# Altium schematic sheet Power_Discrete - Features.SchDoc: Power Discrete - Features
size A3; Date: Not used; ApprovedBy: Not used; CheckedBy: Not used; Author: Not used; CompanyName: STMicroelectronics; DrawnBy: Not used; Engineer: Not used; Organization: Not used; Address1: Not used; Address2: Not used; Address3: Not used; Address4: Not used; DocumentNumber: Not used; Revision: Not used; SheetNumber: 5; SheetTotal: 19; CurrentTime: Not used; CurrentDate: Not used; Time: Not used; DocumentFullPathAndName: Not used; DocumentName: Not used; ModifiedDate: Not used; ImagePath: Not used; ProjectName: Not used; Application_BuildNumber: Not used
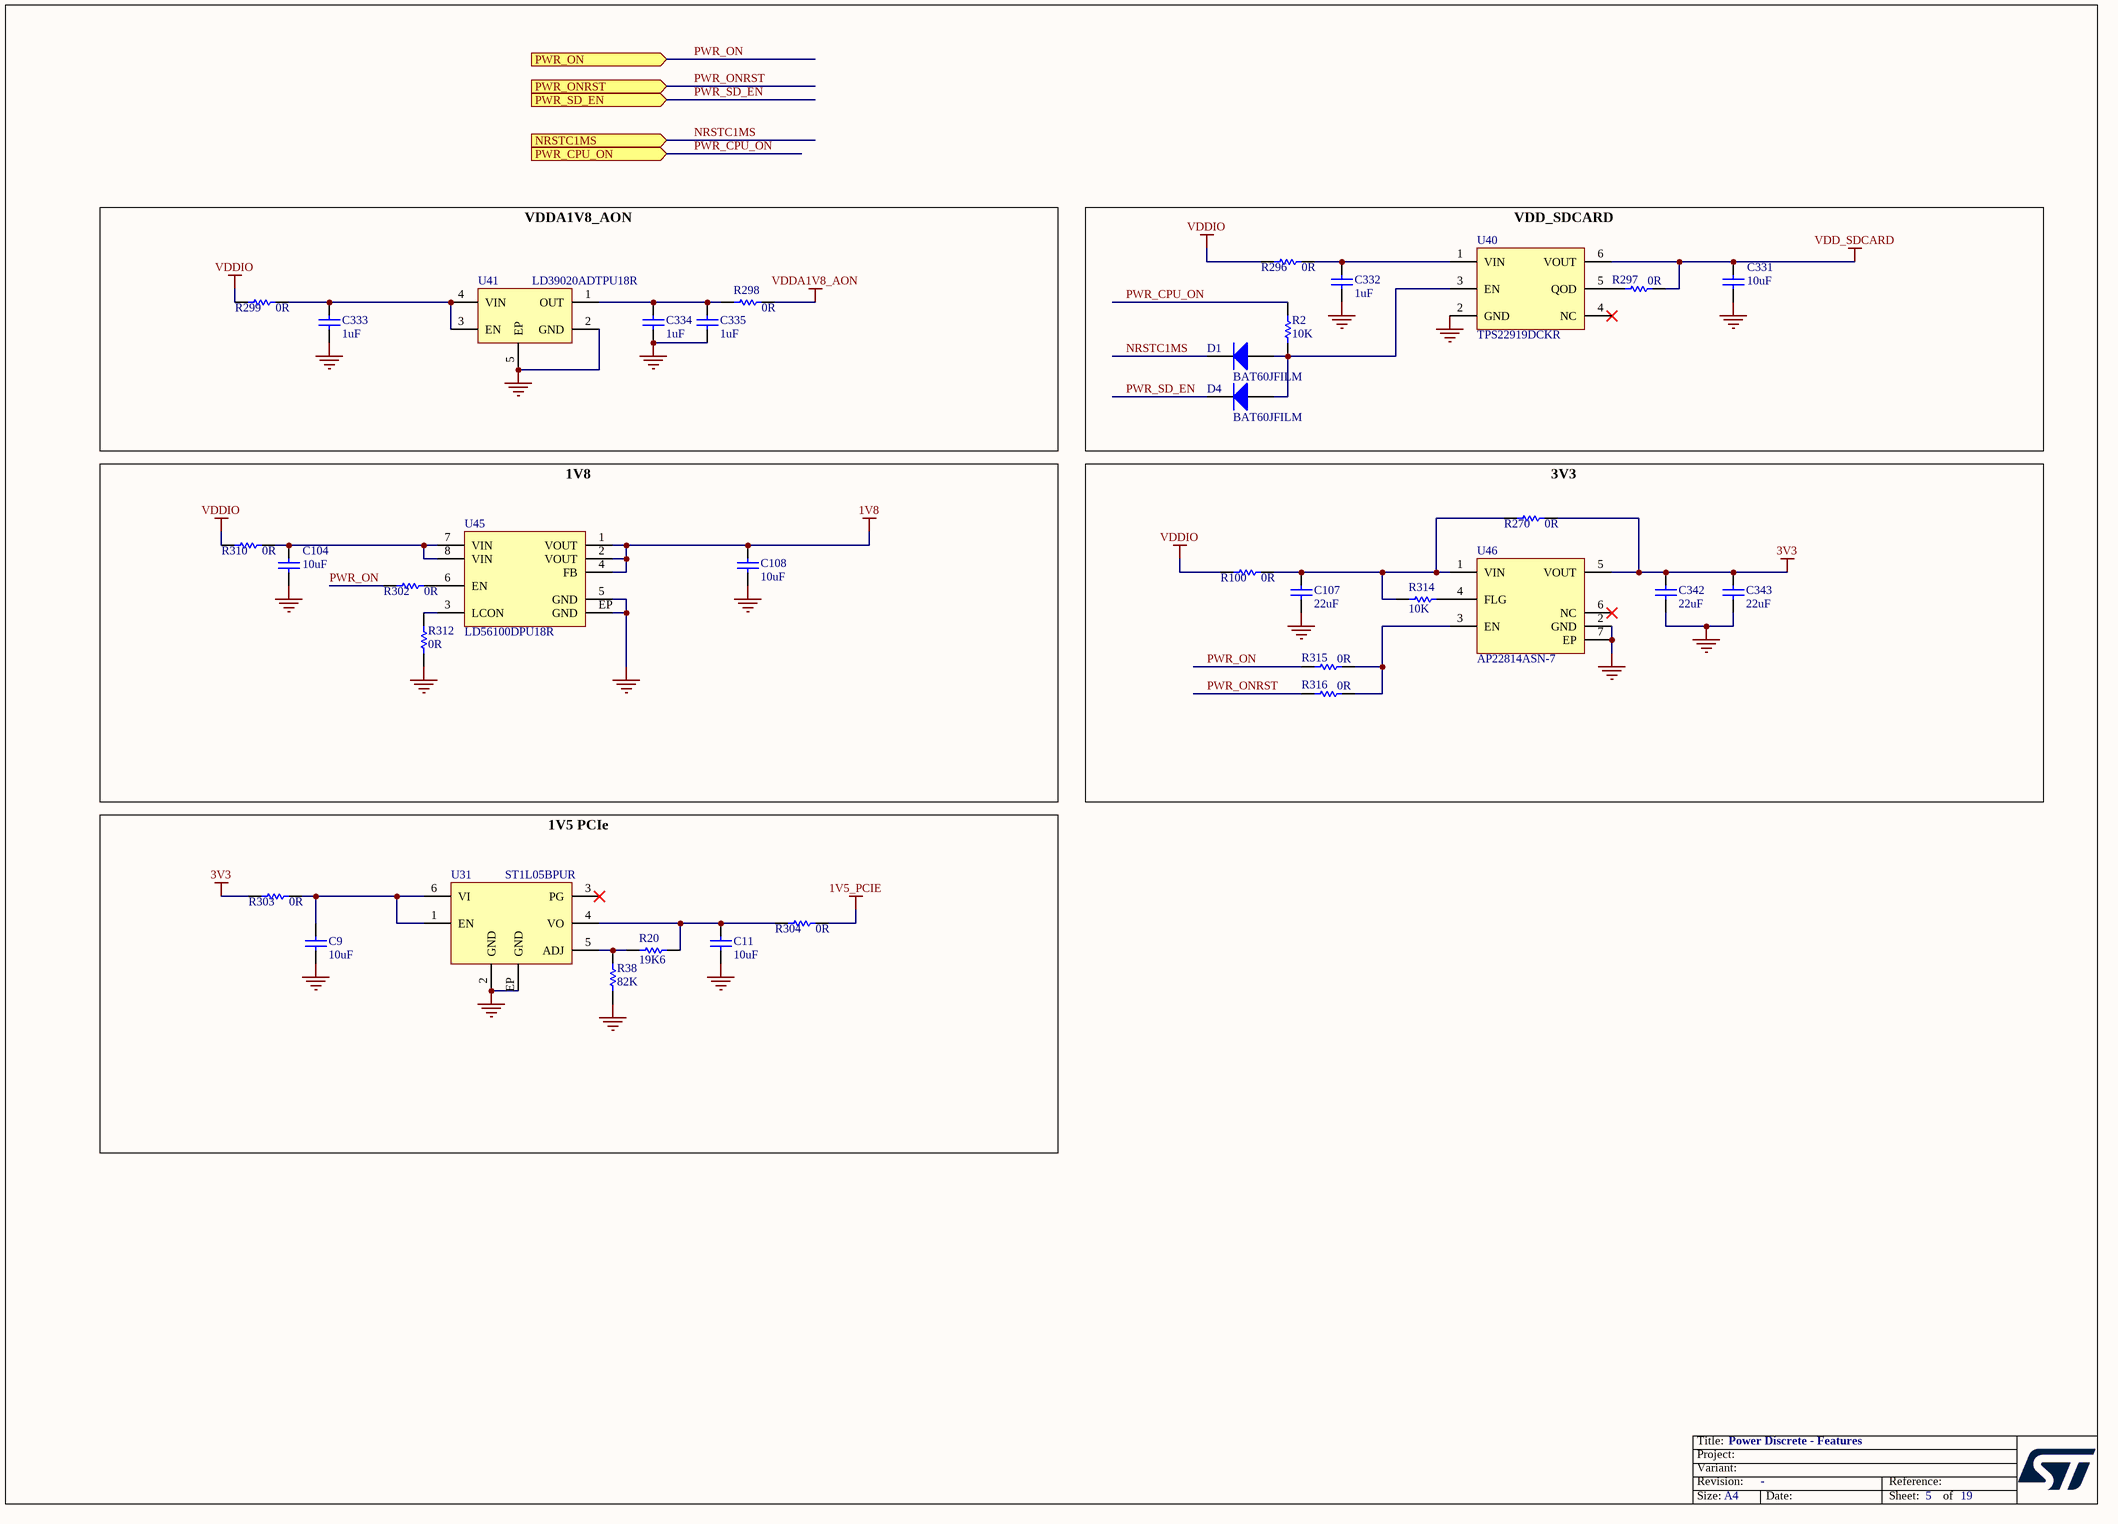
[diagram p0: Power_Discrete - Features.SchDoc]

## Parts
C9  value 10uF  [C0402]  (hidden comment: Capacitor)
C11  value 10uF  [C0402]  (hidden comment: Capacitor)
C104  value 10uF  [C0603]  (hidden comment: Capacitor)
C107  value 22uF  [C0603]  (hidden comment: Capacitor)
C108  value 10uF  [C0603]  (hidden comment: Capacitor)
C331  value 10uF  [C0603]  (hidden comment: Capacitor)
C332  value 1uF  [C0402]  (hidden comment: Capacitor)
C333  value 1uF  [C0402]  (hidden comment: Capacitor)
C334  value 1uF  [C0402]  (hidden comment: Capacitor)
C335  value 1uF  [C0402]  (hidden comment: Capacitor)
C342  value 22uF  [C0603]  (hidden comment: Capacitor)
C343  value 22uF  [C0603]  (hidden comment: Capacitor)
D1  BAT60JFILM  [DIO_SOD323]
D4  BAT60JFILM  [DIO_SOD323]
R2  value 10K  [R0402]  (hidden comment: Resistor)
R20  value 19K6  [R0402]  (hidden comment: Resistor)
R38  value 82K  [R0402]  (hidden comment: Resistor)
R100  value 0R  [R0603]  (hidden comment: Resistor)
R270  value 0R  [R0603]  (hidden comment: Resistor)
R296  value 0R  [R0603]  (hidden comment: Resistor)
R297  value 0R  [R0402]  (hidden comment: Resistor)
R298  value 0R  [R0603]  (hidden comment: Resistor)
R299  value 0R  [R0603]  (hidden comment: Resistor)
R302  value 0R  [R0603]  (hidden comment: Resistor)
R303  value 0R  [R0603]  (hidden comment: Resistor)
R304  value 0R  [R0603]  (hidden comment: Resistor)
R310  value 0R  [R0603]  (hidden comment: Resistor)
R312  value 0R  [R0402]  (hidden comment: Resistor)
R314  value 10K  [R0402]  (hidden comment: Resistor)
R315  value 0R  [R0402]  (hidden comment: Resistor)
R316  value 0R  [R0402]  (hidden comment: Resistor)
U31  ST1L05BPUR  [ICC_DFN6-EPAD_3X3_P095]
U40  value TPS22919DCKR  [ICC_SC70-6_DCK_R-PDSO-G6_2X1P25_P065]  (hidden comment: TPS22919)
U41  value LD39020ADTPU18R  [REG_XDFN4-EPAD_CASE-711AJ_1X1_H0P4_P065]  (hidden comment: LD39020)
U45  LD56100DPU18R  [ICC_DFN8-EPAD_1P6X1P2_P040_H0P45]
U46  AP22814ASN-7

## Ports
NRSTC1MS (in), PWR_CPU_ON (in), PWR_ON (in), PWR_ONRST (in), PWR_SD_EN (in)

## Nets
1V5_PCIE: R304.2
1V8: C108.2 U45.1(VOUT) U45.2(VOUT) U45.4(FB)
3V3: C342.2 C343.2 R270.2 R303.1 U46.5(VOUT)
GND: C9.1 C11.1 C104.1 C107.1 C108.1 C331.1 C332.1 C333.1 C334.1 C335.1 C342.1 C343.1 R38.1 R312.1 U31.2(GND) U31.EP(GND) U40.2(GND) U41.2(GND) U41.5(EP) U45.5(GND) U45.EP(GND) U46.2(GND) U46.7(EP)
VDD_SDCARD: C331.2 R297.2 U40.6(VOUT)
VDDA1V8_AON: R298.2
VDDIO: R100.1 R296.1 R299.1 R310.1
NRSTC1MS: D1.2(K) ; port NRSTC1MS
PWR_CPU_ON: R2.1 ; port PWR_CPU_ON
PWR_ON: R302.1 R315.1 ; port PWR_ON
PWR_ONRST: R316.1 ; port PWR_ONRST
PWR_SD_EN: D4.2(K) ; port PWR_SD_EN
NetC9_2: C9.2 R303.2 U31.1(EN) U31.6(VI)
NetC11_2: C11.2 R20.2 R304.1 U31.4(VO)
NetC104_2: C104.2 R310.2 U45.7(VIN) U45.8(VIN)
NetC107_2: C107.2 R100.2 R270.1 R314.1 U46.1(VIN)
NetC332_2: C332.2 R296.2 U40.1(VIN)
NetC333_2: C333.2 R299.2 U41.3(EN) U41.4(VIN)
NetC334_2: C334.2 C335.2 R298.1 U41.1(OUT)
NetD1_1: D1.1(A) D4.1(A) R2.2 U40.3(EN)
NetR20_1: R20.1 R38.2 U31.5(ADJ)
NetR297_1: R297.1 U40.5(QOD)
NetR302_2: R302.2 U45.6(EN)
NetR312_2: R312.2 U45.3(LCON)
NetR314_2: R314.2 U46.4(FLG)
NetR315_2: R315.2 R316.2 U46.3(EN)

Not connected (* = marked no-connect by the designer): U31 3(PG)*; U40 4(NC)*; U46 6(NC)*

## Notes on the sheet
- VDDA1V8_AON
- VDD_SDCARD
- 1V8
- 3V3
- 1V5 PCIe
- Title:
- Project:
- Size:
- Revision:
- Variant:
- A4
- -
- Date:
- Reference:
- Sheet:
- of

## Library data of the parts
C9 C11 = MCD-01532: Capacitor, MLCC, 10uF, 10V, X5R, +/-20%, 0402, T=0.5mm; Part_Preference: Recommended; Manufacturer: MURATA; Manufacturer_Part_Number: GRM155R61A106ME11; Component_Country_Of_Origin: Japan; ShowFields: YES; ID: 3632; Internal_Part_Number: MCD-01532; Status: Checked; Part_Type: Capacitor; Package: 0402; ComponentLink1URL: http://tunmcdsvn.tun.st.com/Component_Documentation_Library/Trunk/Capacitor/MURATA_GRM_Series; Order_Code_Digikey: N/A; Order_Code_Farnell: N/A; Order_Code_RS: N/A
C104 C331 = MCD-00099: Capacitor, MLCC, 10uF, 10V, X5R, +/-10%, 0603, T=0,8mm; Manufacturer_Part_Number: GRM188R61A106KE69D; Manufacturer: MURATA; Part_Preference: Recommended; Order_Code_RS: 170-6168; Component_Country_Of_Origin: Japan; ID: 2770; ShowFields: YES; Internal_Part_Number: MCD-00099; Status: Released; Part_Type: Capacitor; Package: 0603; ComponentLink1Description: Datasheet; ComponentLink1URL: http://tunmcdsvn.tun.st.com/Component_Documentation_Library/Trunk/Capacitor/MURATA_GRM_Series; Order_Code_Digikey: 490-10474-1-ND; Order_Code_Farnell: 2494233; Alternate_Manufacturer: N/A; Alternate_Manufacturer_Part_Number: N/A
C107 C342 C343 = MCD-00100: Capacitor, MLCC, 22uF, 6V3, X5R, +/-20%, 0603, T=0,8mm; Manufacturer_Part_Number: GRM188R60J226MEA0J; Manufacturer: MURATA; Part_Preference: Recommended; Component_Country_Of_Origin: Japan; ID: 2766; ShowFields: YES; Internal_Part_Number: MCD-00100; Status: Released; Part_Type: Capacitor; Package: 0603; ComponentLink1Description: Datasheet; ComponentLink1URL: http://tunmcdsvn.tun.st.com/Component_Documentation_Library/Trunk/Capacitor/MURATA_GRM_Series; Order_Code_Digikey: 490-7612-2-ND; Order_Code_Farnell: N/A; Order_Code_RS: N/A; Alternate_Manufacturer: N/A; Alternate_Manufacturer_Part_Number: N/A
C108 = MCD-00099: Capacitor, MLCC, 10uF, 10V, X5R, +/-10%, 0603, T=0.8mm; Part_Preference: Recommended; Manufacturer: MURATA; Manufacturer_Part_Number: GRM188R61A106KE69D; Order_Code_RS: 170-6168; Component_Country_Of_Origin: Japan; ShowFields: YES; ID: 2770; Internal_Part_Number: MCD-00099; Status: Released; Part_Type: Capacitor; Package: 0603; ComponentLink1URL: http://tunmcdsvn.tun.st.com/Component_Documentation_Library/Trunk/Capacitor/MURATA_GRM_Series; Order_Code_Digikey: 490-10474-1-ND; Order_Code_Farnell: 2494233
C332 = MCD-00095: Capacitor, MLCC, 1uF, 25V, X5R, +/-10%, 0402, T=0,5mm; Manufacturer_Part_Number: GRM155R61E105KA12; Manufacturer: MURATA; Alternate_Manufacturer_Part_Number: GRM155R60J105KE19; Part_Preference: Recommended; Order_Code_RS: 846-7287; Component_Country_Of_Origin: Japan; ID: 2772; ShowFields: YES; Internal_Part_Number: MCD-00095; Status: Released; Part_Type: Capacitor; Package: 0402; ComponentLink1Description: Datasheet; ComponentLink1URL: http://tunmcdsvn.tun.st.com/Component_Documentation_Library/Trunk/Capacitor/MURATA_GRM_Series; Alternate_Manufacturer: MURATA; Order_Code_Digikey: 490-10017-1-ND; Order_Code_Farnell: 2218855
C333-C335 = MCD-00095: Capacitor, MLCC, 1uF, 25V, X5R, +/-10%, 0402, T=0.5mm; Part_Preference: Recommended; Manufacturer: MURATA; Manufacturer_Part_Number: GRM155R61E105KA12; Alternate_Manufacturer_Part_Number: GRM155R60J105KE19; Order_Code_RS: 846-7287; Component_Country_Of_Origin: Japan; ID: 2772; ShowFields: YES; Internal_Part_Number: MCD-00095; Status: Released; Part_Type: Capacitor; Alternate_Manufacturer: MURATA; Package: 0402; ComponentLink1URL: http://tunmcdsvn.tun.st.com/Component_Documentation_Library/Trunk/Capacitor/MURATA_GRM_Series; Order_Code_Digikey: 490-10017-1-ND; Order_Code_Farnell: 2218855
D1 D4 = MCD-00034: Manufacturer: STMICROELECTRONICS; Part_Type: Diode; BMS_Part_Number: 9151097; Part_Preference: Recommended; Manufacturer_HQ_COO: EU; Component_Country_Of_Origin: China; ID: 2483; ShowFields: YES; Internal_Part_Number: MCD-00034; Value: BAT60JFILM; Manufacturer_Part_Number: BAT60JFILM; ComponentLink1Description: Datasheet; Status: Released; ComponentLink1URL: http://tunmcdsvn.tun.st.com/Component_Datasheet_Library/Trunk/Diodes/STM_Diode_BAT60JFILM-SOD323
R2 R314 = MCD-00053: Resistor,10K,0402,1%,1/16W; Manufacturer_Part_Number: RC0402FR-0710KL; Manufacturer: YAGEO; BMS_Part_Number: 9131590; Part_Preference: Recommended; Component_Country_Of_Origin: China; ID: 2539; ShowFields: YES; Internal_Part_Number: MCD-00053; ComponentLink1Description: Datasheet; Status: Released; Part_Type: Resistor; ComponentLink1URL: http://tunmcdsvn.tun.st.com/Component_Documentation_Library/Trunk/Resistor/YAGEO_RC_L_Series; Package: 0402; Order_Code_Digikey: 311-10.0KLRCT-ND; Order_Code_Farnell: 9239359; Order_Code_RS: N/A; Alternate_Manufacturer: N/A; Alternate_Manufacturer_Part_Number: N/A
R20 = MCD-00344: Resistor, 19K6, 0402, +/-1%, 1/16W; Part_Preference: Recommended; Manufacturer: YAGEO; Manufacturer_Part_Number: RC0402FR-0719K6L; Component_Country_Of_Origin: China; ShowFields: YES; ID: 2937; Internal_Part_Number: MCD-00344; Status: Released; Part_Type: Resistor; Package: 0402; ComponentLink1URL: http://tunmcdsvn.tun.st.com/Component_Documentation_Library/Trunk/Resistor/YAGEO_RC_L_Series; Order_Code_Digikey: YAG3026CT-ND; Order_Code_Farnell: N/A; Order_Code_RS: N/A
R38 = MCD-00531: Resistor, 82K, 0402, +/-1%, 1/16W; Part_Preference: Recommended; Manufacturer: YAGEO; Manufacturer_Part_Number: RC0402FR-0782KL; Component_Country_Of_Origin: China; ShowFields: YES; ID: 3207; Internal_Part_Number: MCD-00531; Status: Released; Part_Type: Resistor; Package: 0402; ComponentLink1URL: http://tunmcdsvn.tun.st.com/Component_Documentation_Library/Trunk/Resistor/YAGEO_RC_L_Series; Order_Code_Digikey: 311-82.0KLRCT-ND; Order_Code_Farnell: 9239464; Order_Code_RS: N/A
R100 R270 R296 R299 R302-R304 R310 = MCD-00056: Resistor,0R,0603,5%,1/10W; Manufacturer_Part_Number: RC0603JR-070RL; Manufacturer: YAGEO; Part_Preference: Recommended; Component_Country_Of_Origin: China; ID: 2536; ShowFields: YES; Internal_Part_Number: MCD-00056; ComponentLink1Description: Datasheet; Status: Released; Part_Type: Resistor; ComponentLink1URL: http://tunmcdsvn.tun.st.com/Component_Documentation_Library/Trunk/Resistor/YAGEO_RC_L_Series; Package: 0603; Order_Code_Digikey: 311-0.0GRCT-ND; Order_Code_Farnell: 9233130RL; Order_Code_RS: N/A; Alternate_Manufacturer: N/A; Alternate_Manufacturer_Part_Number: N/A
R297 R312 R315 R316 = MCD-00052: Resistor,0R,0402,5%,1/16W; Manufacturer_Part_Number: RC0402JR-070RL; Manufacturer: YAGEO; Part_Preference: Recommended; Order_Code_RS: 618-5804; Component_Country_Of_Origin: China; ID: 2540; ShowFields: YES; Internal_Part_Number: MCD-00052; Status: Released; Part_Type: Resistor; ComponentLink1Description: Datasheet; ComponentLink1URL: http://tunmcdsvn.tun.st.com/Component_Documentation_Library/Trunk/Resistor/YAGEO_RC_L_Series; Package: 0402; Order_Code_Digikey: 311-0.0JRCT-ND; Order_Code_Farnell: 9232516RL; Alternate_Manufacturer: N/A; Alternate_Manufacturer_Part_Number: N/A
R298 = MCD-00181: Resistor, 0R, 0603, +/- 0.5mR, 1/4W; Part_Preference: Recommended; Manufacturer: ROHM; Manufacturer_Part_Number: PMR03EZPJ000; Component_Country_Of_Origin: Philippines, Thailand; ID: 2691; ShowFields: YES; Internal_Part_Number: MCD-00181; Status: Released; Part_Type: Resistor; Alternate_Manufacturer: N/A; Alternate_Manufacturer_Part_Number: N/A; Package: 0603; ComponentLink1URL: http://tunmcdsvn.tun.st.com/Component_Documentation_Library/Trunk/Resistor/ROHM_PMR_Series; Order_Code_Digikey: PMR03EZPJ000-ND; Order_Code_Farnell: N/A; Order_Code_RS: N/A
U31 = MCD-00581: LDO Linear Voltage Regulator IC Positive Adjustable 1 Output Adjustable 1.3A 6-DFN (3x3); BMS_Part_Number: 9176239; Part_Preference: Recommended; Manufacturer: STMICROELECTRONICS; Manufacturer_HQ_COO: EU; Component_Country_Of_Origin: Malaysia; ShowFields: YES; ID: 3163; Internal_Part_Number: MCD-00581; Value: ST1L05BPUR; Status: Released; Part_Type: IC; Manufacturer_Part_Number: ST1L05BPUR; Package: DFN6 (3x3); ComponentLink1URL: http://tunmcdsvn.tun.st.com/Component_Datasheet_Library/Trunk/IC/STM_LDO_ST1L05BPUR
U40 = MCD-02311: Power Switch, 1.5A , Input 1.6V to 5.5V; Part_Type: IC; Part_Preference: Recommended; Manufacturer: TEXAS INSTRUMENTS; Component_Country_Of_Origin: Thailand; ID: 4417; ShowFields: YES; Internal_Part_Number: MCD-02311; Status: Checked; Manufacturer_Part_Number: TPS22919DCKR; Alternate_Manufacturer: N/A; Alternate_Manufacturer_Part_Number: N/A; Package: SC70; ComponentLink1URL: http://tunmcdsvn.tun.st.com/Component_Datasheet_Library/Trunk/IC/TI_TPS22919/TPS22919_Datasheet.pdf; Order_Code_Digikey: 296-TPS22919DCKRTR-ND; Order_Code_Farnell: N/A; Order_Code_RS: N/A
U41 = MCD-02224: LDO, output 1V8, 200 mA very low quiescent current; Part_Preference: Recommended; Part_Type: IC; Manufacturer: STMICROELECTRONICS; Manufacturer_HQ_COO: EU; Order_Code_RS: NA; Component_Country_Of_Origin: China; ID: 4324; ShowFields: YES; ComponentLink1URL: http://tunmcdsvn.tun.st.com/Component_Datasheet_Library/Trunk/IC/STM_LDO_LD39020; ComponentLink1Description: Part_Information; Internal_Part_Number: MCD-02224; Status: Checked; Manufacturer_Part_Number: LD39020ADTPU18R; Alternate_Manufacturer: N/A; Alternate_Manufacturer_Part_Number: N/A; Package: DFN4; Order_Code_Digikey: 497-15493-1-ND; Order_Code_Farnell: NA
U45 = MCD-02937: LDO, Input 1V8 to 5V5, Output 1V8, 1A, ultra-low noise; Part_Type: IC; Part_Preference: Recommended; Manufacturer: STMICROELECTRONICS; Order_Code_RS: 203-3404; Component_Country_Of_Origin: China; ShowFields: YES; ID: 5053; Internal_Part_Number: MCD-02937; Value: LD56100DPU18R; Status: New; Manufacturer_Part_Number: LD56100DPU18R; Package: DFN8; ComponentLink1URL: http://tunmcdsvn.tun.st.com/Component_Documentation_Library/Trunk/IC/STMICROELECTRONICS_LD56100DPU18R; Order_Code_Digikey: 497-LD56100DPU18RTR; Order_Code_Farnell: N/A
U46 = MCD-02963: Power Switch , input 2.7 to 5.5V , 3A; Part_Type: IC; Part_Preference: Recommended; Manufacturer: DIODES_INCORPORATED; Order_Code_RS: 1464894P; ShowFields: YES; ID: 5079; Internal_Part_Number: MCD-02963; Value: AP22814ASN-7; Status: New; Manufacturer_Part_Number: AP22814ASN-7; Package: U-DFN2020-6; ComponentLink1URL: http://tunmcdsvn.tun.st.com/Component_Documentation_Library/Trunk/IC/DIODES_INCORPORATED_AP22814ASN-7; Order_Code_Digikey: AP22814ASN-7DITR-ND; Order_Code_Farnell: 2748553